# Altium schematic sheet Additional_PinHeader.SchDoc
size A4; Author: Timo Wilfling; Address1: TH Nürnberg; Address2: Georg Simon Ohm; Address3: Kesslerplatz 10; Address4: 90489 Nürnberg; SheetNumber: 8; SheetTotal: 8
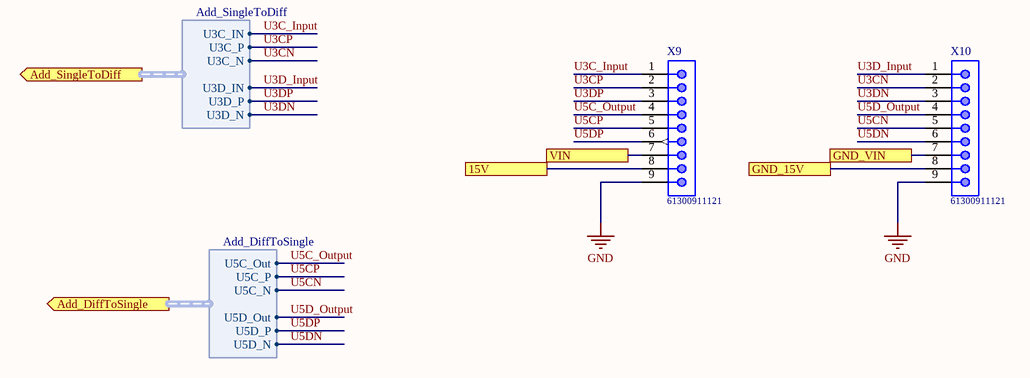
[diagram p0: Additional_PinHeader.SchDoc]

## Parts
X9  61300911121  [61300911121]
X10  61300911121  [61300911121]

## Ports
15V, Add_DiffToSingle (out, harness Add_DiffToSingle), Add_SingleToDiff (out, harness Add_SingleToDiff), GND_15V, GND_VIN, VIN

## Harnesses
Add_SingleToDiff: U3C_IN, U3C_P, U3C_N, U3D_IN, U3D_P, U3D_N
Add_DiffToSingle: U5C_Out, U5C_P, U5C_N, U5D_Out, U5D_P, U5D_N

## Nets
GND: X9.9 X10.9
15V: X9.8 ; port 15V
GND_15V: X10.8 ; port GND_15V
GND_VIN: X10.7 ; port GND_VIN
U3C_Input: X9.1 ; port Add_SingleToDiff.U3C_IN
U3CN: X10.2 ; port Add_SingleToDiff.U3C_N
U3CP: X9.2 ; port Add_SingleToDiff.U3C_P
U3D_Input: X10.1 ; port Add_SingleToDiff.U3D_IN
U3DN: X10.3 ; port Add_SingleToDiff.U3D_N
U3DP: X9.3 ; port Add_SingleToDiff.U3D_P
U5C_Output: X9.4 ; port Add_DiffToSingle.U5C_Out
U5CN: X10.5 ; port Add_DiffToSingle.U5C_N
U5CP: X9.5 ; port Add_DiffToSingle.U5C_P
U5D_Output: X10.4 ; port Add_DiffToSingle.U5D_Out
U5DN: X10.6 ; port Add_DiffToSingle.U5D_N
U5DP: X9.6 ; port Add_DiffToSingle.U5D_P
VIN: X9.7 ; port VIN

## Notes on the sheet
- Title
- Size:
- Date:
- A4
- Revision:
- Time:
- Sheet
- of
- Author:
- Project:

## Library data of the parts
X9 X10 = 61300911121: Pin Header, 2.54mm, 9 Pins, Single Row; Manufacturer: WURTH; Created from: TWilfling; Number of positions: 9; Manufacturer Part Number: 61300911121; PartID: 4; Created On: 18.05.2021 08:47:30; ComponentLink1Description: Datasheet; ComponentLink1URL: https://www.we-online.com/catalog/datasheet/61300211121.pdf; ComponentLink2Description: Homepage; ComponentLink2URL: https://www.we-online.com/catalog/en/PHD_2_54_THT_PIN_HEADER_6130XX11121; Component Type: Pin Header; Device Package: THT; Last Updated: 18.05.2021 14:06:54; Mounting Type: THT; Supplier 1: Wurth Electronik; Supplier Part Number 1: 61300911121; Type: Pin Header THT; Live Cycle Status: 1; Stock number: not stored; Number of rows: 1